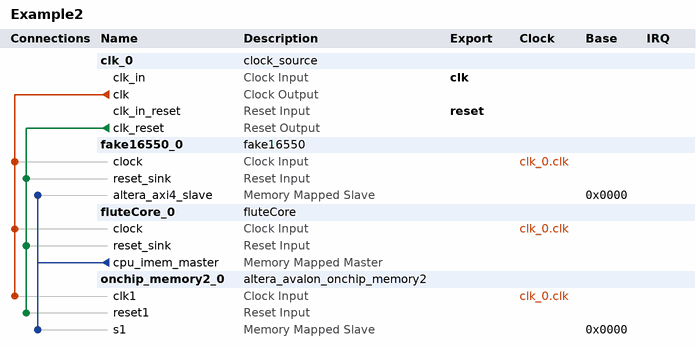
[diagram p0: system contents]
# Platform Designer (Qsys) system Example2, Cyclone V 5CGXFC7C7F23C8
# Parameters at their usual value, and those the tool derives, are not listed.
package require -exact qsys 21.1
create_system Example2
set_project_property DEVICE_FAMILY {Cyclone V}
set_project_property DEVICE 5CGXFC7C7F23C8

add_instance clk_0 clock_source 21.1
set_instance_parameter_value clk_0 clockFrequency 50000000

add_instance fake16550_0 fake16550 1.0

add_instance fluteCore_0 fluteCore 1.0

add_instance onchip_memory2_0 altera_avalon_onchip_memory2 21.1
set_instance_parameter_value onchip_memory2_0 dataWidth 32
set_instance_parameter_value onchip_memory2_0 dualPort false
set_instance_parameter_value onchip_memory2_0 initMemContent true
set_instance_parameter_value onchip_memory2_0 initializationFileName onchip_mem.hex
set_instance_parameter_value onchip_memory2_0 memorySize 4096

# connections
add_connection clk_0.clk fake16550_0.clock clock
add_connection clk_0.clk fluteCore_0.clock clock
add_connection clk_0.clk onchip_memory2_0.clk1 clock
add_connection clk_0.clk_reset fake16550_0.reset_sink reset
add_connection clk_0.clk_reset fluteCore_0.reset_sink reset
add_connection clk_0.clk_reset onchip_memory2_0.reset1 reset
add_connection fluteCore_0.cpu_imem_master fake16550_0.altera_axi4_slave avalon
set_connection_parameter_value fluteCore_0.cpu_imem_master/fake16550_0.altera_axi4_slave baseAddress 0x0000
add_connection fluteCore_0.cpu_imem_master onchip_memory2_0.s1 avalon
set_connection_parameter_value fluteCore_0.cpu_imem_master/onchip_memory2_0.s1 baseAddress 0x0000

# exported interfaces
add_interface clk clock sink
set_interface_property clk EXPORT_OF clk_0.clk_in
add_interface reset reset sink
set_interface_property reset EXPORT_OF clk_0.clk_in_reset

set_interconnect_requirement {$system} qsys_mm.clockCrossingAdapter HANDSHAKE
set_interconnect_requirement {$system} qsys_mm.enableEccProtection FALSE
set_interconnect_requirement {$system} qsys_mm.insertDefaultSlave FALSE
set_interconnect_requirement {$system} qsys_mm.maxAdditionalLatency 1

save_system Example2.qsys
